# EAGLE board untitled (EAGLE 9.6.2), part 1 of 3
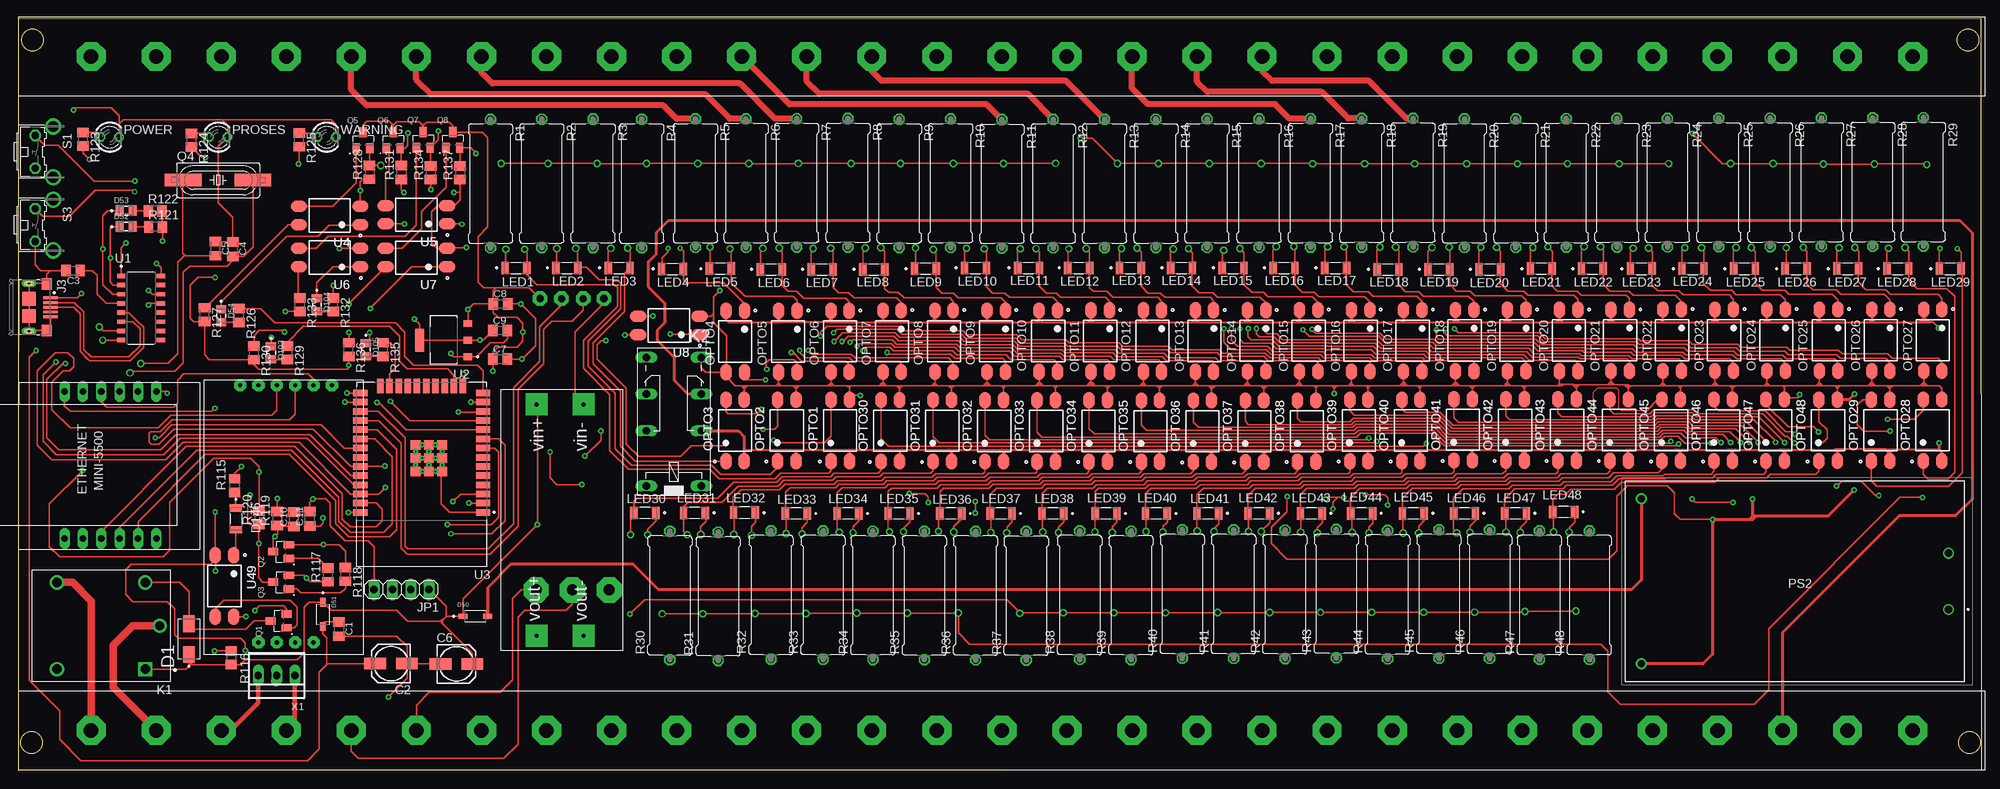
[diagram p2: board, top side]
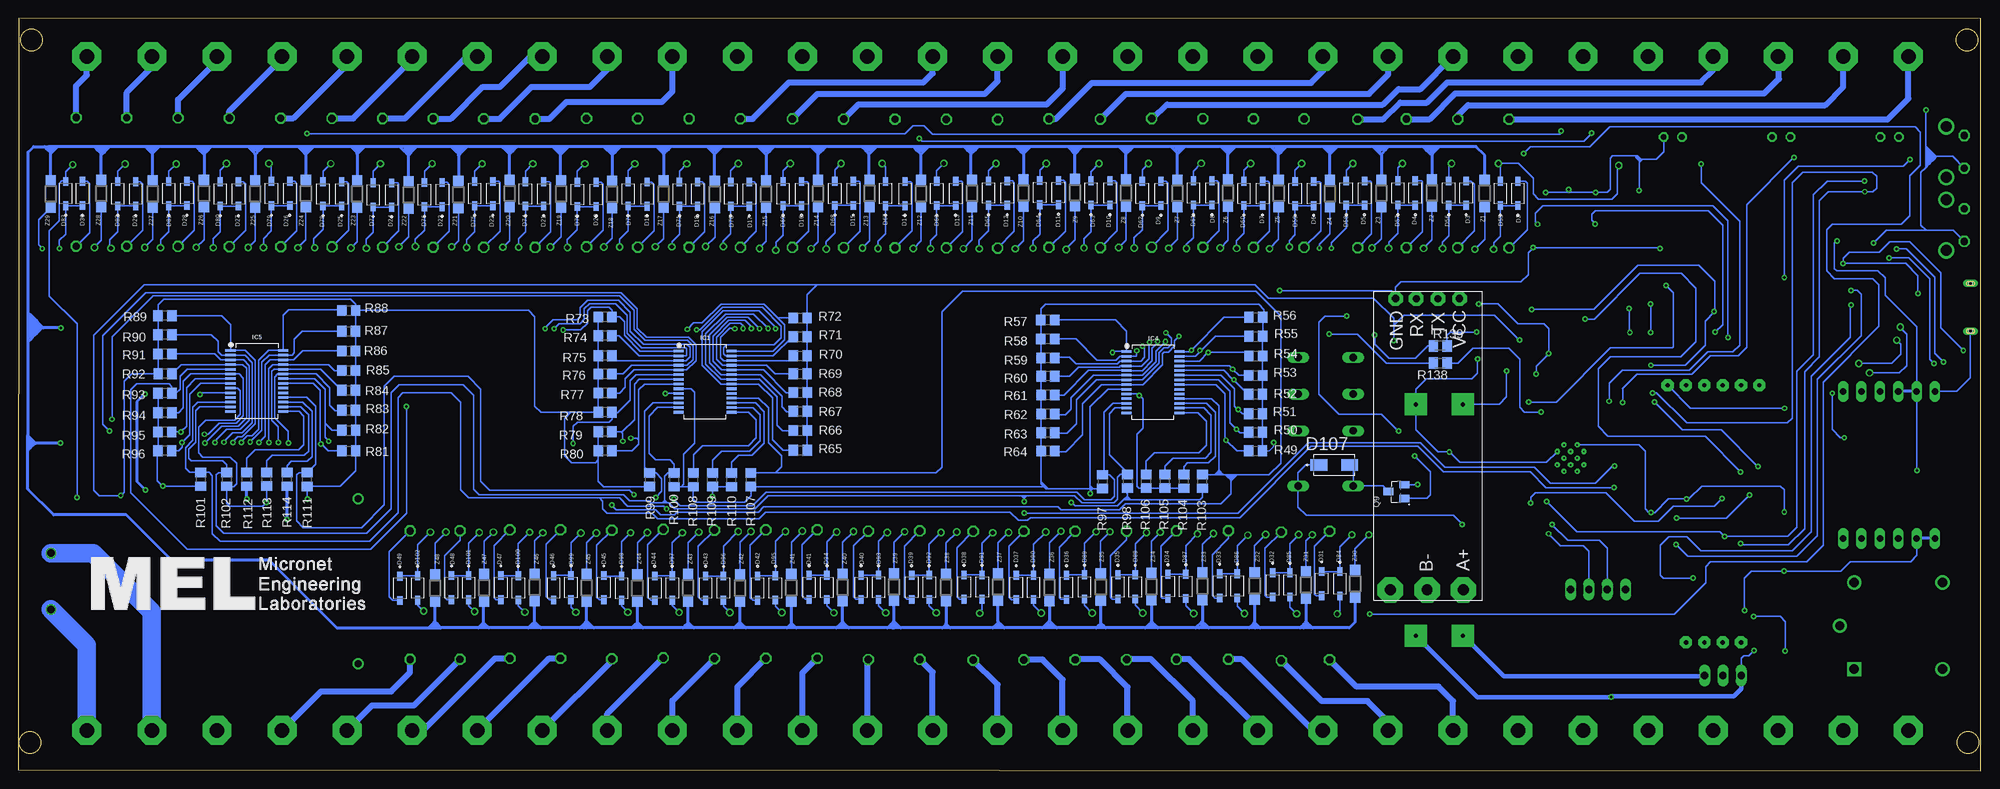
[diagram p3: board, bottom side, seen from below]

Size 271.55 x 104.1 mm. Coordinates in mm from the lower left corner, seen from the top.
Outline: 0,104 271.45,104.1 271.55,0.15 0,0 0,104
Outline: circle at 269.9,3.88 radius 1.48
Outline: circle at 269.7,101.08 radius 1.48
Outline: circle at 1.9,101.08 radius 1.48
Outline: circle at 1.8,3.88 radius 1.48
Copper layers (1*16): Top 0.035mm / dielectric 1.5mm / Bottom 0.035mm
Design rules "default *": minimum track width 6mil, minimum drill 0.3mm, track to track 6mil, track to pad 6mil, pad to pad 6mil, via to via 6mil, smd to smd 6mil, copper to edge 40mil, drill to drill 6mil, minimum pad ring 10mil, minimum via ring 8mil, stop-mask expansion 4mil, vias tented up to drill 0mil, thermal gap 10mil
Net classes: 0 default: drill 0.3 mm, clearance 0.2 mm

## Footprints (pad centres in the part's own frame; a part is rotated, then mirrored left to right if it is on the bottom)
C0805K = smd 1.3 x 1.6: 1 -1,0; 2 1,0
153CLV-0505 = smd 3 x 1.6: + 2.2,0; - -2.2,0
DIOM5226X240N = smd 2.33 x 1.55: A 2.135,0; C -2.135,0
SOD3715X145N = smd 1.21 x 0.73: A 1.68,0; C -1.68,0
LEDC2012X120N = smd 1.1 x 1.45: A 0.9,0; C -0.9,0
LEDC3216X120N = smd 1.01 x 1.73: + -1.51,0; - 1.51,0
HEADER-29P = drill 2 pad 4 octagon: 1 -116.62,5.07; 2 -107.62,5.07; 3 -98.62,5.07; 4 -89.62,5.07; 5 -80.62,5.07; 6 -71.62,5.07; 7 -62.62,5.07; 8 -53.62,5.07; 9 -44.62,5.07; 10 -35.62,5.07; 11 -26.62,5.07; 12 -17.62,5.07; 13 -8.62,5.07; 14 0.38,5.07; 15 9.38,5.07; 16 18.38,5.07; 17 27.38,5.07; 18 36.38,5.07; 19 45.38,5.07; 20 54.38,5.07; 21 63.38,5.07; 22 72.38,5.07; 23 81.38,5.07; 24 90.38,5.07; 25 99.38,5.07; 26 108.38,5.07; 27 117.38,5.07; 28 126.38,5.07; 29 135.38,5.07
SSOP28DB = smd 0.348 x 1.397: 1 -4.225,-3.656; 2 -3.575,-3.656; 3 -2.925,-3.656; 4 -2.275,-3.656; 5 -1.625,-3.656; 6 -0.975,-3.656; 7 -0.325,-3.656; 8 0.325,-3.656; 9 0.975,-3.656; 10 1.625,-3.656; 11 2.275,-3.656; 12 2.925,-3.656; 13 3.575,-3.656; 14 4.225,-3.656; 15 4.225,3.656; 16 3.575,3.656; 17 2.925,3.656; 18 2.275,3.656; 19 1.625,3.656; 20 0.975,3.656; 21 0.325,3.656; 22 -0.325,3.656; 23 -0.975,3.656; 24 -1.625,3.656; 25 -2.275,3.656; 26 -2.925,3.656; 27 -3.575,3.656; 28 -4.225,3.656
FCI_10118193-0001LF = smd 0.4 x 2: 1 -1.3,2.975; 2 -0.65,2.975; 3 0,2.975; 4 0.65,2.975; 5 1.3,2.975 | smd 1.6 x 1.4: S1 -3.2,2.45; S2 3.2,2.45 | smd 1.9 x 1.9: S3 1.2,0; S4 -1.2,0 | drill 0.5 pad 0.9 long: S5 -3.3,0; S6 3.3,0 | hole 0.5: -3.3,0; 3.3,0
1X04 = drill 1.016 long: 1 -3.81,0; 2 -1.27,0; 3 1.27,0; 4 3.81,0
RELAY_SRD-05VDC-SL-C = drill 1.32 square: A1 -6.1,6 | drill 1.32: A2 -6.1,-6; NC 6.1,6; NO 6.1,-6 | drill 1.29: COM -8.1,0
351 = drill 1.016 long: 1 -3.81,-3.81; 16 -3.81,3.81; O1 8.89,-3.81; O2 8.89,3.81; P1 3.81,-3.81; P2 3.81,3.81; S1 13.97,-3.81; S2 13.97,3.81
MT3608 = drill 0.6 pad 3 square: VIN+ 22,-3; VIN- 22,-9.5; VOUT+ -10,-3; VOUT- -10,-9.5
SOT254P975X400-4N = smd 2.25 x 1.6: 1 -4.25,1.27; 2 -4.25,-1.27; 3 4.25,-1.27; 4 4.25,1.27
LED3MM = drill 0.813 octagon: A -1.27,0; K 1.27,0
HLK10M05 = drill 1 pad 1.5: 1 0,0; 2 0,-7.8; 3 42.5,7.5; 4 42.5,-15.3
SOT95P240X120-3N = smd 1 x 1.4: 1 -0.95,-1.1; 2 0.95,-1.1; 3 0,1.1
SM49 = smd 5.08 x 1.778: 1 -4.826,0; 2 4.826,0
0617/17 = drill 1.016 octagon: 1 -8.89,0; 2 8.89,0
R0805 = smd 1.3 x 1.5: 1 -0.95,0; 2 0.95,0
M0805 = smd 1.3 x 1.6: 1 -0.95,0; 2 0.95,0
RTC3231 = drill 0.6 pad 1.676 octagon: 32K -15.24,0; GND -15.24,12.7; GND1 20.32,10.16; SCL -15.24,5.08; SCL1 20.32,2.54; SDA -15.24,7.62; SDA1 20.32,5.08; SQW -15.24,2.54; VCC -15.24,10.16; VCC1 20.32,7.62
B3F-31XX = drill 1.016 octagon: 1 -2.261,-1.245; 2 2.261,-1.245 | drill 1.499 pad 2.159: 3 -3.505,1.245; 4 3.505,1.245
TTL-RS485 = drill 1.5 pad 3.5 octagon: A -19.7,-6; B -19.7,-1; P$7 -19.7,4.1 | drill 1 pad 2 octagon: GND 20.6,3.37; RX 20.581,0.505; TX 20.583,-2.493; VCC 20.6,-5.47
SOIC127P600X180-16N = smd 1.31 x 0.62: 1 -2.75,4.445; 2 -2.75,3.175; 3 -2.75,1.905; 4 -2.75,0.635; 5 -2.75,-0.635; 6 -2.75,-1.905; 7 -2.75,-3.175; 8 -2.75,-4.445; 9 2.75,-4.445; 10 2.75,-3.175; 11 2.75,-1.905; 12 2.75,-0.635; 13 2.75,0.635; 14 2.75,1.905; 15 2.75,3.175; 16 2.75,4.445
SOT229P700X180-4N = smd 1.31 x 0.93: 1 -3.345,2.29; 2 -3.345,0; 3 -3.345,-2.29 | smd 1.31 x 3.24: 4 3.345,0
MODULE_ESP32-WROOM-32D = smd 2 x 0.9: 1 -8.5,5.26; 2 -8.5,3.99; 3 -8.5,2.72; 4 -8.5,1.45; 5 -8.5,0.18; 6 -8.5,-1.09; 7 -8.5,-2.36; 8 -8.5,-3.63; 9 -8.5,-4.9; 10 -8.5,-6.17; 11 -8.5,-7.44; 12 -8.5,-8.71; 13 -8.5,-9.98; 14 -8.5,-11.25; 25 8.5,-11.25; 26 8.5,-9.98; 27 8.5,-8.71; 28 8.5,-7.44; 29 8.5,-6.17; 30 8.5,-4.9; 31 8.5,-3.63; 32 8.5,-2.36; 33 8.5,-1.09; 34 8.5,0.18; 35 8.5,1.45; 36 8.5,2.72; 37 8.5,3.99; 38 8.5,5.26 | smd 0.9 x 2: 15 -5.715,-12.25; 16 -4.445,-12.25; 17 -3.175,-12.25; 18 -1.905,-12.25; 19 -0.635,-12.25; 20 0.635,-12.25; 21 1.905,-12.25; 22 3.175,-12.25; 23 4.445,-12.25; 24 5.715,-12.25 | smd 1.33 x 1.33: 39_1 -2.835,-0.405; 39_2 -1,-0.405; 39_3 0.835,-0.405; 39_4 -2.835,-2.24; 39_5 -1,-2.24; 39_6 0.835,-2.24; 39_7 -2.835,-4.075; 39_8 -1,-4.075; 39_9 0.835,-4.075 | drill 0.2 pad 0.3: 39_10 -1.917,-0.405; 39_11 -0.083,-0.405; 39_12 -2.835,-1.323; 39_13 -1,-1.323; 39_14 0.835,-1.323; 39_15 -1.917,-2.24; 39_16 -0.083,-2.24; 39_17 -2.835,-3.158; 39_18 -1,-3.158; 39_19 0.835,-3.158; 39_20 -1.917,-4.075; 39_21 -0.083,-4.075
MINI_W5500 = drill 0.914 long: 3V3 21.844,-8.89; 3V3.2 21.844,-11.43; CS 1.524,-16.51; GND 1.524,-6.35; GND.2 1.524,-8.89; GND.3 21.844,-6.35; INT 1.524,-19.05; MISO 21.844,-19.05; MOSI 1.524,-11.43; NC 21.844,-13.97; RST 21.844,-16.51; SCLK 1.524,-13.97
22-23-2031 = drill 1 long: 1 -2.54,0; 2 0,0; 3 2.54,0
SOD123 = smd 1.4 x 1.4: A 1.9,0; C -1.9,0

## Placement (x,y rotation side)
C1  1uF  [C0805K]  44.33,19.59 270 top
C2  10uF/16V  [153CLV-0505]  51.52,14.81 180 top
C3  100nF  [C0805K]  7.52,69.16 180 top
C4  22pF  [C0805K]  29.63,72.14 270 top
C5  22pF  [C0805K]  27.23,72.22 270 top
C6  10uF/16V  [153CLV-0505]  60.57,14.78 0 top
C7  1uF  [C0805K]  66.62,56.92 0 top
C8  10uF  [C0805K]  66.66,64.57 0 top
C9  10uF  [C0805K]  66.6,60.86 0 top
C10  100nF  [C0805K]  38.07,34.79 90 top
C11  100nF  [C0805K]  40.27,34.84 90 top
D1  US1M-13  [DIOM5226X240N]  23.56,18.2 90 top
D2  1N5819HW-7  [SOD3715X145N]  64.06,79.85 90 bottom
D3  1N5819HW-7  [SOD3715X145N]  71.2,79.88 90 bottom
D4  1N5819HW-7  [SOD3715X145N]  78.25,79.91 90 bottom
D5  1N5819HW-7  [SOD3715X145N]  85.27,79.88 90 bottom
D6  1N5819HW-7  [SOD3715X145N]  92.3,79.81 90 bottom
D7  1N5819HW-7  [SOD3715X145N]  99.37,79.86 90 bottom
D8  1N5819HW-7  [SOD3715X145N]  106.37,79.92 90 bottom
D9  1N5819HW-7  [SOD3715X145N]  113.44,79.85 90 bottom
D10  1N5819HW-7  [SOD3715X145N]  120.5,79.91 90 bottom
D11  1N5819HW-7  [SOD3715X145N]  127.62,79.96 90 bottom
D12  1N5819HW-7  [SOD3715X145N]  134.7,79.9 90 bottom
D13  1N5819HW-7  [SOD3715X145N]  141.83,79.85 90 bottom
D14  1N5819HW-7  [SOD3715X145N]  148.85,79.81 90 bottom
D15  1N5819HW-7  [SOD3715X145N]  156,79.86 90 bottom
D16  1N5819HW-7  [SOD3715X145N]  163.14,79.81 90 bottom
D17  1N5819HW-7  [SOD3715X145N]  170.38,79.75 90 bottom
D18  1N5819HW-7  [SOD3715X145N]  177.54,79.75 90 bottom
D19  1N5819HW-7  [SOD3715X145N]  184.51,79.74 90 bottom
D20  1N5819HW-7  [SOD3715X145N]  191.57,79.71 90 bottom
D21  1N5819HW-7  [SOD3715X145N]  198.84,79.79 90 bottom
D22  1N5819HW-7  [SOD3715X145N]  205.86,79.83 90 bottom
D23  1N5819HW-7  [SOD3715X145N]  212.86,79.68 90 bottom
D24  1N5819HW-7  [SOD3715X145N]  219.85,79.62 90 bottom
D25  1N5819HW-7  [SOD3715X145N]  226.78,79.79 90 bottom
D26  1N5819HW-7  [SOD3715X145N]  233.95,79.84 90 bottom
D27  1N5819HW-7  [SOD3715X145N]  241.06,79.77 90 bottom
D28  1N5819HW-7  [SOD3715X145N]  248.18,79.84 90 bottom
D29  1N5819HW-7  [SOD3715X145N]  255.28,79.79 90 bottom
D30  1N5819HW-7  [SOD3715X145N]  262.64,79.84 90 bottom
D31  1N5819HW-7  [SOD3715X145N]  91.2,25.87 270 bottom
D32  1N5819HW-7  [SOD3715X145N]  97.98,25.7 270 bottom
D33  1N5819HW-7  [SOD3715X145N]  105.31,25.57 270 bottom
D34  1N5819HW-7  [SOD3715X145N]  112.45,25.5 270 bottom
D35  1N5819HW-7  [SOD3715X145N]  119.36,25.42 270 bottom
D36  1N5819HW-7  [SOD3715X145N]  126.5,25.36 270 bottom
D37  1N5819HW-7  [SOD3715X145N]  133.46,25.34 270 bottom
D38  1N5819HW-7  [SOD3715X145N]  140.66,25.39 270 bottom
D39  1N5819HW-7  [SOD3715X145N]  147.92,25.37 270 bottom
D40  1N5819HW-7  [SOD3715X145N]  154.91,25.37 270 bottom
D41  1N5819HW-7  [SOD3715X145N]  162.12,25.36 270 bottom
D42  1N5819HW-7  [SOD3715X145N]  169.23,25.26 270 bottom
D43  1N5819HW-7  [SOD3715X145N]  176.42,25.27 270 bottom
D44  1N5819HW-7  [SOD3715X145N]  183.47,25.26 270 bottom
D45  1N5819HW-7  [SOD3715X145N]  190.5,25.32 270 bottom
D46  1N5819HW-7  [SOD3715X145N]  197.46,25.3 270 bottom
D47  1N5819HW-7  [SOD3715X145N]  204.76,25.32 270 bottom
D48  1N5819HW-7  [SOD3715X145N]  211.59,25.31 270 bottom
D49  1N5819HW-7  [SOD3715X145N]  218.72,25.23 270 bottom
D50  1N5819HW-7  [SOD3715X145N]  63.19,21.36 0 top
D51  1N5819HW-7  [SOD3715X145N]  42.09,21.63 270 top
D52  SML-LXT0805IW-TR  [LEDC2012X120N]  14.87,75.26 0 top
D53  SML-LXT0805IW-TR  [LEDC2012X120N]  14.87,77.46 0 top
D54  SML-LXT0805IW-TR  [LEDC2012X120N]  28.02,62.92 270 top
D55  1N5819HW-7  [SOD3715X145N]  66.46,79.84 90 bottom
D56  1N5819HW-7  [SOD3715X145N]  73.61,79.9 90 bottom
D57  1N5819HW-7  [SOD3715X145N]  80.64,79.91 90 bottom
D58  1N5819HW-7  [SOD3715X145N]  87.8,79.88 90 bottom
D59  1N5819HW-7  [SOD3715X145N]  94.87,79.82 90 bottom
D60  1N5819HW-7  [SOD3715X145N]  101.96,79.85 90 bottom
D61  1N5819HW-7  [SOD3715X145N]  108.94,79.91 90 bottom
D62  1N5819HW-7  [SOD3715X145N]  116.01,79.83 90 bottom
D63  1N5819HW-7  [SOD3715X145N]  123.11,79.91 90 bottom
D64  1N5819HW-7  [SOD3715X145N]  130.2,79.95 90 bottom
D65  1N5819HW-7  [SOD3715X145N]  137.3,79.89 90 bottom
D66  1N5819HW-7  [SOD3715X145N]  144.45,79.85 90 bottom
D67  1N5819HW-7  [SOD3715X145N]  151.55,79.81 90 bottom
D68  1N5819HW-7  [SOD3715X145N]  158.54,79.86 90 bottom
D69  1N5819HW-7  [SOD3715X145N]  165.7,79.8 90 bottom
D70  1N5819HW-7  [SOD3715X145N]  172.95,79.75 90 bottom
D71  1N5819HW-7  [SOD3715X145N]  180.06,79.74 90 bottom
D72  1N5819HW-7  [SOD3715X145N]  187.14,79.78 90 bottom
D73  1N5819HW-7  [SOD3715X145N]  194.18,79.71 90 bottom
D74  1N5819HW-7  [SOD3715X145N]  201.36,79.78 90 bottom
D75  1N5819HW-7  [SOD3715X145N]  208.39,79.83 90 bottom
D76  1N5819HW-7  [SOD3715X145N]  215.33,79.67 90 bottom
D77  1N5819HW-7  [SOD3715X145N]  222.43,79.65 90 bottom
D78  1N5819HW-7  [SOD3715X145N]  229.36,79.79 90 bottom
D79  1N5819HW-7  [SOD3715X145N]  236.5,79.83 90 bottom
D80  1N5819HW-7  [SOD3715X145N]  243.6,79.77 90 bottom
D81  1N5819HW-7  [SOD3715X145N]  250.7,79.83 90 bottom
D82  1N5819HW-7  [SOD3715X145N]  257.76,79.8 90 bottom
D83  1N5819HW-7  [SOD3715X145N]  264.95,79.82 90 bottom
D84  1N5819HW-7  [SOD3715X145N]  88.68,25.86 270 bottom
D85  1N5819HW-7  [SOD3715X145N]  95.6,25.7 270 bottom
D86  1N5819HW-7  [SOD3715X145N]  102.87,25.56 270 bottom
D87  1N5819HW-7  [SOD3715X145N]  109.99,25.5 270 bottom
D88  1N5819HW-7  [SOD3715X145N]  116.99,25.43 270 bottom
D89  1N5819HW-7  [SOD3715X145N]  124.01,25.42 270 bottom
D90  1N5819HW-7  [SOD3715X145N]  131.06,25.35 270 bottom
D91  1N5819HW-7  [SOD3715X145N]  138.17,25.4 270 bottom
D92  1N5819HW-7  [SOD3715X145N]  145.5,25.37 270 bottom
D93  1N5819HW-7  [SOD3715X145N]  152.5,25.37 270 bottom
D94  1N5819HW-7  [SOD3715X145N]  159.65,25.36 270 bottom
D95  1N5819HW-7  [SOD3715X145N]  166.77,25.29 270 bottom
D96  1N5819HW-7  [SOD3715X145N]  173.97,25.25 270 bottom
D97  1N5819HW-7  [SOD3715X145N]  181.04,25.27 270 bottom
D98  1N5819HW-7  [SOD3715X145N]  188.05,25.24 270 bottom
D99  1N5819HW-7  [SOD3715X145N]  195.06,25.32 270 bottom
D100  1N5819HW-7  [SOD3715X145N]  202.35,25.29 270 bottom
D101  1N5819HW-7  [SOD3715X145N]  209.2,25.31 270 bottom
D102  1N5819HW-7  [SOD3715X145N]  216.26,25.27 270 bottom
D103  SML-LXT0805IW-TR  [LEDC2012X120N]  34.93,57.82 270 top
D104  SML-LXT0805IW-TR  [LEDC2012X120N]  41.26,64.45 270 top
D105  SML-LXT0805IW-TR  [LEDC2012X120N]  48.04,58.25 270 top
D107  US1M-13  [DIOM5226X240N]  89.45,42.29 0 bottom
D146  LHN974_RED_LED_1206  [LEDC3216X120N]  30.06,34.83 270 top
HEADER-29P1  [HEADER-29P]  126.65,93.72 0 top
HEADER-29P2  [HEADER-29P]  126.65,0.52 0 top
IC1  MCP23017SS  [SSOP28DB]  176.51,53.81 270 bottom
IC4  MCP23017SS  [SSOP28DB]  114.53,53.73 270 bottom
IC5  MCP23017SS  [SSOP28DB]  238.51,53.9 270 bottom
J3  10118193-0001LF  [FCI_10118193-0001LF]  1.43,64.09 270 top
JP1  [1X04]  52.96,25.08 180 top
K1  SRD-05VDC-SL-C  [RELAY_SRD-05VDC-SL-C]  11.42,20.04 180 top
K2  351  [351]  90.65,43.2 90 top
LED1  LHN974_RED_LED_1206  [LEDC3216X120N]  68.81,69.56 0 top
LED2  LHN974_RED_LED_1206  [LEDC3216X120N]  75.85,69.56 0 top
LED3  LHN974_RED_LED_1206  [LEDC3216X120N]  83.09,69.56 0 top
LED4  LHN974_RED_LED_1206  [LEDC3216X120N]  90.46,69.41 0 top
LED5  LHN974_RED_LED_1206  [LEDC3216X120N]  97.08,69.45 0 top
LED6  LHN974_RED_LED_1206  [LEDC3216X120N]  104.12,69.35 0 top
LED7  LHN974_RED_LED_1206  [LEDC3216X120N]  111.16,69.35 0 top
LED8  LHN974_RED_LED_1206  [LEDC3216X120N]  118.3,69.35 0 top
LED9  LHN974_RED_LED_1206  [LEDC3216X120N]  125.44,69.45 0 top
LED10  LHN974_RED_LED_1206  [LEDC3216X120N]  132.38,69.55 0 top
LED11  LHN974_RED_LED_1206  [LEDC3216X120N]  139.72,69.55 0 top
LED12  LHN974_RED_LED_1206  [LEDC3216X120N]  146.66,69.55 0 top
LED13  LHN974_RED_LED_1206  [LEDC3216X120N]  153.8,69.55 0 top
LED14  LHN974_RED_LED_1206  [LEDC3216X120N]  160.88,69.54 0 top
LED15  LHN974_RED_LED_1206  [LEDC3216X120N]  168.02,69.54 0 top
LED16  LHN974_RED_LED_1206  [LEDC3216X120N]  175.06,69.54 0 top
LED17  LHN974_RED_LED_1206  [LEDC3216X120N]  182.2,69.54 0 top
LED18  LHN974_RED_LED_1206  [LEDC3216X120N]  189.44,69.34 0 top
LED19  LHN974_RED_LED_1206  [LEDC3216X120N]  196.48,69.34 0 top
LED20  LHN974_RED_LED_1206  [LEDC3216X120N]  203.52,69.34 0 top
LED21  LHN974_RED_LED_1206  [LEDC3216X120N]  210.66,69.44 0 top
LED22  LHN974_RED_LED_1206  [LEDC3216X120N]  217.7,69.44 0 top
LED23  LHN974_RED_LED_1206  [LEDC3216X120N]  224.48,69.43 0 top
LED24  LHN974_RED_LED_1206  [LEDC3216X120N]  231.62,69.43 0 top
LED25  LHN974_RED_LED_1206  [LEDC3216X120N]  238.76,69.43 0 top
LED26  LHN974_RED_LED_1206  [LEDC3216X120N]  245.9,69.43 0 top
LED27  LHN974_RED_LED_1206  [LEDC3216X120N]  253.04,69.43 0 top
LED28  LHN974_RED_LED_1206  [LEDC3216X120N]  259.98,69.43 0 top
LED29  LHN974_RED_LED_1206  [LEDC3216X120N]  267.22,69.43 0 top
LED30  LHN974_RED_LED_1206  [LEDC3216X120N]  86.64,35.67 180 top
LED31  LHN974_RED_LED_1206  [LEDC3216X120N]  93.5,35.67 180 top
LED32  LHN974_RED_LED_1206  [LEDC3216X120N]  100.42,35.68 180 top
LED33  LHN974_RED_LED_1206  [LEDC3216X120N]  107.58,35.58 180 top
LED34  LHN974_RED_LED_1206  [LEDC3216X120N]  114.74,35.58 180 top
LED35  LHN974_RED_LED_1206  [LEDC3216X120N]  121.8,35.58 180 top
LED36  LHN974_RED_LED_1206  [LEDC3216X120N]  128.96,35.58 180 top
LED37  LHN974_RED_LED_1206  [LEDC3216X120N]  135.92,35.58 180 top
LED38  LHN974_RED_LED_1206  [LEDC3216X120N]  143.08,35.58 180 top
LED39  LHN974_RED_LED_1206  [LEDC3216X120N]  150.44,35.58 180 top
LED40  LHN974_RED_LED_1206  [LEDC3216X120N]  157.4,35.58 180 top
LED41  LHN974_RED_LED_1206  [LEDC3216X120N]  164.52,35.59 180 top
LED42  LHN974_RED_LED_1206  [LEDC3216X120N]  171.58,35.59 180 top
LED43  LHN974_RED_LED_1206  [LEDC3216X120N]  178.84,35.59 180 top
LED44  LHN974_RED_LED_1206  [LEDC3216X120N]  185.8,35.59 180 top
LED45  LHN974_RED_LED_1206  [LEDC3216X120N]  192.96,35.59 180 top
LED46  LHN974_RED_LED_1206  [LEDC3216X120N]  200.02,35.59 180 top
LED47  LHN974_RED_LED_1206  [LEDC3216X120N]  207.08,35.59 180 top
LED48  LHN974_RED_LED_1206  [LEDC3216X120N]  213.74,35.79 180 top
MT1  [MT3608]  68.66,28.67 90 top
OPTO1  PC817X2NIP0F  [SOT254P975X400-4N]  113.65,47.04 90 top
OPTO2  PC817X2NIP0F  [SOT254P975X400-4N]  106.27,47.06 90 top
OPTO3  PC817X2NIP0F  [SOT254P975X400-4N]  99.12,47.04 90 top
OPTO4  PC817X2NIP0F  [SOT254P975X400-4N]  99.13,59.36 270 top
OPTO5  PC817X2NIP0F  [SOT254P975X400-4N]  106.43,59.37 270 top
OPTO6  PC817X2NIP0F  [SOT254P975X400-4N]  113.63,59.38 270 top
OPTO7  PC817X2NIP0F  [SOT254P975X400-4N]  120.83,59.39 270 top
OPTO8  PC817X2NIP0F  [SOT254P975X400-4N]  128.03,59.4 270 top
OPTO9  PC817X2NIP0F  [SOT254P975X400-4N]  135.23,59.41 270 top
OPTO10  PC817X2NIP0F  [SOT254P975X400-4N]  142.43,59.42 270 top
OPTO11  PC817X2NIP0F  [SOT254P975X400-4N]  149.63,59.43 270 top
OPTO12  PC817X2NIP0F  [SOT254P975X400-4N]  156.86,59.43 270 top
OPTO13  PC817X2NIP0F  [SOT254P975X400-4N]  164.06,59.44 270 top
OPTO14  PC817X2NIP0F  [SOT254P975X400-4N]  171.26,59.45 270 top
OPTO15  PC817X2NIP0F  [SOT254P975X400-4N]  178.46,59.46 270 top
OPTO16  PC817X2NIP0F  [SOT254P975X400-4N]  185.66,59.47 270 top
OPTO17  PC817X2NIP0F  [SOT254P975X400-4N]  192.86,59.48 270 top
OPTO18  PC817X2NIP0F  [SOT254P975X400-4N]  200.06,59.49 270 top
OPTO19  PC817X2NIP0F  [SOT254P975X400-4N]  207.26,59.5 270 top
OPTO20  PC817X2NIP0F  [SOT254P975X400-4N]  214.46,59.51 270 top
OPTO21  PC817X2NIP0F  [SOT254P975X400-4N]  221.56,59.52 270 top
OPTO22  PC817X2NIP0F  [SOT254P975X400-4N]  228.76,59.53 270 top
OPTO23  PC817X2NIP0F  [SOT254P975X400-4N]  235.96,59.54 270 top
OPTO24  PC817X2NIP0F  [SOT254P975X400-4N]  243.16,59.55 270 top
OPTO25  PC817X2NIP0F  [SOT254P975X400-4N]  250.42,59.53 270 top
OPTO26  PC817X2NIP0F  [SOT254P975X400-4N]  257.62,59.54 270 top
OPTO27  PC817X2NIP0F  [SOT254P975X400-4N]  264.82,59.55 270 top
OPTO28  PC817X2NIP0F  [SOT254P975X400-4N]  264.78,47.09 90 top
OPTO29  PC817X2NIP0F  [SOT254P975X400-4N]  257.6,47.07 90 top
OPTO30  PC817X2NIP0F  [SOT254P975X400-4N]  120.58,47.02 90 top
OPTO31  PC817X2NIP0F  [SOT254P975X400-4N]  127.78,47.01 90 top
OPTO32  PC817X2NIP0F  [SOT254P975X400-4N]  134.98,47 90 top
OPTO33  PC817X2NIP0F  [SOT254P975X400-4N]  142.18,46.99 90 top
OPTO34  PC817X2NIP0F  [SOT254P975X400-4N]  149.38,46.98 90 top
OPTO35  PC817X2NIP0F  [SOT254P975X400-4N]  156.58,46.97 90 top
OPTO36  PC817X2NIP0F  [SOT254P975X400-4N]  163.78,46.96 90 top
OPTO37  PC817X2NIP0F  [SOT254P975X400-4N]  170.98,46.95 90 top
OPTO38  PC817X2NIP0F  [SOT254P975X400-4N]  178.22,46.97 90 top
OPTO39  PC817X2NIP0F  [SOT254P975X400-4N]  185.42,47.06 90 top
OPTO40  PC817X2NIP0F  [SOT254P975X400-4N]  192.62,47.05 90 top
OPTO41  PC817X2NIP0F  [SOT254P975X400-4N]  199.82,47.14 90 top
OPTO42  PC817X2NIP0F  [SOT254P975X400-4N]  207.02,47.13 90 top
OPTO43  PC817X2NIP0F  [SOT254P975X400-4N]  214.22,47.12 90 top
OPTO44  PC817X2NIP0F  [SOT254P975X400-4N]  221.42,47.11 90 top
OPTO45  PC817X2NIP0F  [SOT254P975X400-4N]  228.62,47.1 90 top
OPTO46  PC817X2NIP0F  [SOT254P975X400-4N]  235.82,47.09 90 top
OPTO47  PC817X2NIP0F  [SOT254P975X400-4N]  243.02,47.08 90 top
OPTO48  PC817X2NIP0F  [SOT254P975X400-4N]  250.32,47.07 90 top
POWER  TLLY4400  [LED3MM]  12.62,87.65 0 top
PROSES  TLLY4400  [LED3MM]  27.62,87.65 0 top
PS2  HLK-10M05  [HLK10M05]  267,22.3 180 top
Q1  S9013  [SOT95P240X120-3N]  35.99,20.71 90 top
Q2  MMBT3904  [SOT95P240X120-3N]  36.29,30.31 90 top
Q3  MMBT3904  [SOT95P240X120-3N]  36.29,26.09 90 top
Q4  12MHz  [SM49]  27.6,81.7 0 top
Q5  S9013  [SOT95P240X120-3N]  47.64,87.2 0 top
Q6  S9013  [SOT95P240X120-3N]  51.82,87.2 0 top
Q7  S9013  [SOT95P240X120-3N]  55.96,87.24 0 top
Q8  S9013  [SOT95P240X120-3N]  60.07,87.24 0 top
Q9  S9013  [SOT95P240X120-3N]  80.87,38.6 90 bottom
R1  [0617/17]  65.27,81.21 270 top
R2  [0617/17]  72.37,81.23 270 top
R3  [0617/17]  79.47,81.25 270 top
R4  [0617/17]  86.2,81.22 270 top
R5  [0617/17]  93.63,81.26 270 top
R6  [0617/17]  100.63,81.28 270 top
R7  [0617/17]  107.63,81.3 270 top
R8  [0617/17]  114.73,81.32 270 top
R9  [0617/17]  121.83,81.24 270 top
R10  [0617/17]  128.93,81.26 270 top
R11  [0617/17]  136.03,81.18 270 top
R12  [0617/17]  143.13,81.2 270 top
R13  [0617/17]  150.23,81.22 270 top
R14  [0617/17]  157.33,81.24 270 top
R15  [0617/17]  164.42,81.26 270 top
R16  [0617/17]  171.62,81.28 270 top
R17  [0617/17]  178.72,81.3 270 top
R18  [0617/17]  185.82,81.32 270 top
R19  [0617/17]  192.92,81.34 270 top
R20  [0617/17]  200.02,81.26 270 top
R21  [0617/17]  207.12,81.28 270 top
R22  [0617/17]  214.12,81.3 270 top
R23  [0617/17]  221.12,81.32 270 top
R24  [0617/17]  228.12,81.34 270 top
R25  [0617/17]  235.21,81.36 270 top
R26  [0617/17]  242.31,81.38 270 top
R27  [0617/17]  249.41,81.4 270 top
R28  [0617/17]  256.51,81.42 270 top
R29  [0617/17]  263.51,81.44 270 top
R30  [0617/17]  90.09,24.24 90 top
R31  [0617/17]  96.79,24.12 90 top
R32  [0617/17]  104.09,24.3 90 top
R33  [0617/17]  111.29,24.28 90 top
R34  [0617/17]  118.19,24.26 90 top
R35  [0617/17]  125.3,24.24 90 top
R36  [0617/17]  132.4,24.22 90 top
R37  [0617/17]  139.4,24.2 90 top
R38  [0617/17]  146.8,24.28 90 top
R39  [0617/17]  153.9,24.26 90 top
R40  [0617/17]  161,24.44 90 top
R41  [0617/17]  168.1,24.42 90 top
R42  [0617/17]  175.2,24.4 90 top
R43  [0617/17]  182.3,24.48 90 top
R44  [0617/17]  189.4,24.36 90 top
R45  [0617/17]  196.51,24.44 90 top
R46  [0617/17]  203.51,24.42 90 top
R47  [0617/17]  210.41,24.3 90 top
R48  [0617/17]  217.31,24.28 90 top
R49  [R0805]  100.34,44.25 0 bottom
R50  [R0805]  100.34,46.8 0 bottom
R51  [R0805]  100.34,49.38 0 bottom
R52  [R0805]  100.34,52.05 0 bottom
R53  [R0805]  100.33,54.67 0 bottom
R54  [R0805]  100.31,57.36 0 bottom
R55  [R0805]  100.31,60.07 0 bottom
R56  [R0805]  100.3,62.7 0 bottom
R57  [R0805]  129.09,62.34 180 bottom
R58  [R0805]  129.09,59.7 180 bottom
R59  [R0805]  129.07,57.08 180 bottom
R60  [R0805]  129.06,54.57 180 bottom
R61  [R0805]  129.06,51.96 180 bottom
R62  [R0805]  129.06,49.33 180 bottom
R63  [R0805]  129.07,46.74 180 bottom
R64  [R0805]  129.05,44.23 180 bottom
R65  [R0805]  163.32,44.33 0 bottom
R66  [R0805]  163.33,47.05 0 bottom
R67  [R0805]  163.33,49.7 0 bottom
R68  [R0805]  163.33,52.3 0 bottom
R69  [R0805]  163.35,54.9 0 bottom
R70  [R0805]  163.35,57.4 0 bottom
R71  [R0805]  163.34,60.05 0 bottom
R72  [R0805]  163.34,62.62 0 bottom
R73  [R0805]  190.32,62.76 180 bottom
R74  [R0805]  190.33,60.16 180 bottom
R75  [R0805]  190.34,57.42 180 bottom
R76  [R0805]  190.33,54.87 180 bottom
R77  [R0805]  190.34,52.24 180 bottom
R78  [R0805]  190.33,49.56 180 bottom
R79  [R0805]  190.34,46.89 180 bottom
R80  [R0805]  190.34,44.25 180 bottom
R81  [R0805]  225.8,44.24 0 bottom
R82  [R0805]  225.8,47.07 0 bottom
R83  [R0805]  225.81,49.86 0 bottom
R84  [R0805]  225.81,52.61 0 bottom
R85  [R0805]  225.81,55.36 0 bottom
R86  [R0805]  225.81,58.04 0 bottom
R87  [R0805]  225.81,60.76 0 bottom
R88  [R0805]  225.8,63.66 0 bottom
R89  [R0805]  251.23,62.93 180 bottom
R90  [R0805]  251.22,60.3 180 bottom
R91  [R0805]  251.23,57.64 180 bottom
R92  [R0805]  251.22,54.89 180 bottom
R93  [R0805]  251.23,52.2 180 bottom
R94  [R0805]  251.24,49.52 180 bottom
R95  [R0805]  251.25,46.86 180 bottom
R96  [R0805]  251.25,44.27 180 bottom
R97  [R0805]  121.54,39.98 270 bottom
R98  [R0805]  118.07,40.04 270 bottom
R99  [R0805]  184.16,40.25 270 bottom
R100  [R0805]  180.79,40.23 270 bottom
R101  [R0805]  246.27,40.3 270 bottom
R102  [R0805]  242.69,40.29 270 bottom
R103  [R0805]  107.71,40.02 90 bottom
R104  [R0805]  110.27,40.01 90 bottom
R105  [R0805]  112.88,40.03 90 bottom
R106  [R0805]  115.47,40.04 90 bottom
R107  [R0805]  170.17,40.24 270 bottom
R108  [R0805]  178.12,40.23 90 bottom
R109  [R0805]  175.49,40.23 90 bottom
R110  [R0805]  172.84,40.23 90 bottom
R111  [R0805]  231.56,40.27 90 bottom
R112  [R0805]  239.94,40.29 90 bottom
R113  [R0805]  237.17,40.3 90 bottom
R114  [R0805]  234.33,40.29 90 bottom
R115  [R0805]  29.91,39.43 90 top
R116  [R0805]  29.39,15.62 270 top
R117  10k  [M0805]  42.77,27.09 90 top
R118  10k  [M0805]  45.23,27.16 270 top
R119  10k  [M0805]  35.77,34.89 90 top
R120  10k  [M0805]  33.27,34.99 90 top
R121  330  [M0805]  18.94,75.23 0 top
R122  330  [M0805]  18.89,77.43 0 top
R123  330  [M0805]  8.93,87.35 270 top
R124  330  [M0805]  23.93,87.2 270 top
R125  330  [M0805]  38.83,87.25 270 top
R126  330  [M0805]  30.5,62.95 270 top
R127  10k  [M0805]  25.74,63.08 270 top
R128  10k  [M0805]  48.55,82.75 90 top
R129  330  [M0805]  37.19,57.8 270 top
R130  10k  [M0805]  32.57,57.79 270 top
R131  10k  [M0805]  52.95,82.73 90 top
R132  330  [M0805]  43.53,64.44 270 top
R133  10k  [M0805]  38.91,64.44 270 top
R134  10k  [M0805]  57,82.71 90 top
R135  330  [M0805]  50.42,58.25 270 top
R136  10k  [M0805]  45.67,58.25 270 top
R137  10k  [M0805]  61.06,82.71 90 top
R138  330  [M0805]  74.8,56.38 180 bottom
R139  10k  [M0805]  74.8,58.77 0 bottom
RTC1  [RTC3231]  30.64,38.07 270 top
S1  [B3F-31XX]  3.54,85.6 270 top
S3  [B3F-31XX]  3.54,75.47 270 top
TTL-RS1  [TTL-RS485]  77.6,44.71 90 bottom
U1  CH340G  [SOIC127P600X180-16N]  16.94,64 0 top
U2  AMS1117  [SOT229P700X180-4N]  58.82,59.55 180 top
U3  ESP32-WROOM-32D  [MODULE_ESP32-WROOM-32D]  55.76,40.99 180 top
U4  PC817X2NIP0F  [SOT254P975X400-4N]  43.01,76.81 180 top
U5  PC817X2NIP0F  [SOT254P975X400-4N]  55.02,76.9 180 top
U6  PC817X2NIP0F  [SOT254P975X400-4N]  43.03,70.97 180 top
U7  PC817X2NIP0F  [SOT254P975X400-4N]  55.02,70.96 180 top
U8  PC817X2NIP0F  [SOT254P975X400-4N]  89.96,61.59 180 top
U49  PC817X2NIP0F  [SOT254P975X400-4N]  28.48,25.55 270 top
U$1  MINI_W5500  [MINI_W5500]  0,30.61 90 top
WARNING  TLLY4400  [LED3MM]  42.62,87.65 0 top
X1  22-23-2031  [22-23-2031]  35.68,13.17 180 top
Z1  [SOD123]  68.65,79.86 90 bottom
Z2  [SOD123]  75.95,79.91 90 bottom
Z3  [SOD123]  82.95,79.86 90 bottom
Z4  [SOD123]  90.05,79.81 90 bottom
Z5  [SOD123]  97.15,79.86 90 bottom
Z6  [SOD123]  104.15,79.91 90 bottom
Z7  [SOD123]  111.15,79.86 90 bottom
Z8  [SOD123]  118.25,79.91 90 bottom
Z9  [SOD123]  125.35,79.96 90 bottom
Z10  [SOD123]  132.45,79.91 90 bottom
Z11  [SOD123]  139.55,79.86 90 bottom
Z12  [SOD123]  146.65,79.81 90 bottom
Z13  [SOD123]  153.75,79.86 90 bottom
Z14  [SOD123]  160.85,79.81 90 bottom
Z15  [SOD123]  168.05,79.76 90 bottom
Z16  [SOD123]  175.15,79.71 90 bottom
Z17  [SOD123]  182.25,79.76 90 bottom
Z18  [SOD123]  189.35,79.71 90 bottom
Z19  [SOD123]  196.43,79.79 90 bottom
Z20  [SOD123]  203.53,79.84 90 bottom
Z21  [SOD123]  210.63,79.69 90 bottom
Z22  [SOD123]  217.53,79.64 90 bottom
Z23  [SOD123]  224.63,79.79 90 bottom
Z24  [SOD123]  231.73,79.84 90 bottom
Z25  [SOD123]  238.73,79.79 90 bottom
Z26  [SOD123]  245.83,79.84 90 bottom
Z27  [SOD123]  252.93,79.79 90 bottom
Z28  [SOD123]  260.03,79.84 90 bottom
Z29  [SOD123]  267.03,79.79 90 bottom
Z30  [SOD123]  86.57,25.86 270 bottom
Z31  [SOD123]  93.37,25.71 270 bottom
Z32  [SOD123]  100.47,25.56 270 bottom
Z33  [SOD123]  107.67,25.51 270 bottom
Z34  [SOD123]  114.77,25.46 270 bottom
Z35  [SOD123]  121.77,25.41 270 bottom
Z36  [SOD123]  128.87,25.36 270 bottom
Z37  [SOD123]  135.97,25.41 270 bottom
Z38  [SOD123]  143.17,25.36 270 bottom
Z39  [SOD123]  150.37,25.41 270 bottom
Z40  [SOD123]  157.47,25.36 270 bottom
Z41  [SOD123]  164.57,25.31 270 bottom
Z42  [SOD123]  171.67,25.26 270 bottom
Z43  [SOD123]  178.87,25.31 270 bottom
Z44  [SOD123]  185.87,25.26 270 bottom
Z45  [SOD123]  192.87,25.31 270 bottom
Z46  [SOD123]  200.07,25.36 270 bottom
Z47  [SOD123]  207.07,25.31 270 bottom
Z48  [SOD123]  213.87,25.26 270 bottom

## Tracks (layer width: path | path; a pad name or v marks a point on that pad's centre or on a via)
24+
  Top 0.61: X1.1 38.22,6.78 HEADER-29P2.4
  Bottom 0.61: MT1.VOUT+ 71.58,18.67 65.98,13.07 38.32,13.07 X1.1
A+
  Top 0.203: TTL-RS1.A 69.53,25.01 68.35,23.83 68.35,12.57 66.61,10.83 56.78,10.83 55.03,9.08 HEADER-29P2.6
B-
  Top 0.203: HEADER-29P2.5 46.03,2.7 47,1.73 67.13,1.73 69.09,3.69 69.09,21.25 70,22.16 75.74,22.16 76.6,23.03 TTL-RS1.B
COMM
  Top 0.406: K2.O1 92.63,52.09 90.77,53.94 90.77,57.12 88.41,59.48 88.41,61.01 89.45,62.05 89.45,64.59 87.14,66.9 87.14,70.43 88.23,71.52 88.23,74.44 89.91,76.12 268.55,76.12 270.26,74.41 270.26,37.57 267.94,35.25 260.22,35.25 244.03,19.06 HEADER-29P2.27
COMM1  (via drill 0.35)
  Top 0.203: 107.18,44.39 107.54,44.03 OPTO2.2 107.54,44.03 107.89,44.39 | 114.92,44.01 OPTO1.2 114.92,44.01 | 114.92,44.01 114.55,44.39 | 114.92,44.01 115.31,44.4 | OPTO30.2 121.85,44.01 122.24,44.4 | 129.05,43.97 OPTO31.2 129.05,43.97 | 129.05,43.97 129.48,44.4 | 129.05,43.97 128.62,44.4
  Top 0.305: OPTO4.2 97.86,62.35 98.19,62.02 104.39,62.02 | 104.39,62.02 104.74,62.02 | 104.74,62.02 105.2,62.02 105.19,62.01 | 105.19,62 105.19,62.01 | 105.19,62.01 105.19,63.59 OPTO5.2 | 112.3,62 112.36,62 OPTO6.2 | 112.3,62 111.85,62 | 111.85,62 105.63,62 | 105.63,62 105.19,62 | 105.19,62 105.06,62 | 112.3,62 112.31,62.01 112.85,62.01 | 112.85,62.01 119.09,62.01 | 119.09,62.01 119.39,62.01 | 119.39,62.01 119.65,62.28 119.65,63.55 OPTO7.2 | 120.08,62.02 119.72,62.02 119.71,62.01 | 120.08,62.02 120.29,62.02 | 120.29,62.02 126.26,62.02 | 126.26,62.02 126.61,62.02 | 126.61,62.02 126.78,62.18 126.78,63.63 OPTO8.2 | 126.61,62.02 127.25,62.02 | 127.25,62.02 133.5,62.02 | 133.5,62.02 133.88,62.02 | 133.88,62.02 134,62.14 134,63.62 OPTO9.2 | 140.97,62.02 141.21,62.26 141.21,63.62 OPTO10.2 | 140.97,62.02 141.67,62.02 | 141.67,62.02 147.87,62.02 | 147.87,62.02 148.18,62.02 | 148.36,62.2 OPTO11.2 | 148.81,62.01 155.11,62.01 | 155.11,62.01 155.51,62.01 | 155.51,62.01 155.66,62.16 155.66,63.61 OPTO12.2 | 155.51,62.01 156.13,62.01 | 156.13,62.01 162.35,62.01 | 162.35,62.01 162.66,62.01 | 162.66,62.01 | 162.66,62.01 162.85,62.2 162.85,63.63 OPTO13.2 | 162.66,62.01 163.29,62.01 | 163.29,62.01 169.51,62.01 | 169.51,62.01 169.82,62.01 | 169.82,62.01 170.03,62.22 170.03,63.66 OPTO14.2 | 169.82,62.01 170.5,62.01 | 170.5,62.01 176.7,62.01 | 176.7,62.01 177.04,62.01 | 177.04,62.01 177.19,62.16 OPTO15.2 | 177.04,62.01 177.62,62.01 | 177.62,62.01 183.89,62.01 | 183.89,62.01 183.96,62.01 | 183.96,62.01 184.18,62.01 184.39,62.22 OPTO16.2 | 183.96,62.01 183.96,62.02 184.88,62.02 | 184.88,62.02 191.2,62.02 | 191.2,62.02 | 191.2,62.02 191.89,62.02 | 191.89,62.02 198.34,62.02
  Top 0.305: 198.34,62.02 198.52,62.02 | 198.52,62.02 198.82,62.31 198.82,63.71 OPTO18.2 | 198.52,62.02 199.31,62.02 | 199.31,62.02 205.38,62.02 | 205.38,62.02 205.51,62.02 | 205.51,62.02 | 205.51,62.02 205.79,62.3 | 205.79,62.3 206,62.51 206,63.74 OPTO19.2 | 205.51,62.02 206.49,62.02 | 206.49,62.02 212.67,62.02 | 212.67,62.02 212.82,62.02 | OPTO20.2 213.19,62.39 | 213.19,62.39 212.82,62.02 | 212.82,62.02 213.66,62.02 | 213.66,62.02 219.8,62.02 | 219.8,62.02 219.94,62.02 | OPTO21.2 220.29,62.37 219.94,62.02 | 219.94,62.02 220.24,62.02 | 220.24,62.02 220.77,62.02 | 220.77,62.02 227.24,62.02 | OPTO22.2 227.49,62.27 227.24,62.02 | 227.24,62.02 234.18,62.02 | 234.18,62.02 234.37,62.02 | 234.37,62.02 234.7,62.35 234.7,63.78 OPTO23.2 | 234.37,62.02 235.07,62.02 | 235.07,62.02 235.25,62.02 | 235.25,62.02 241.37,62.02 | 241.37,62.02 241.61,62.02 | OPTO24.2 241.89,62.29 241.61,62.02 | 241.61,62.02 242.31,62.02 | 242.31,62.02 248.74,62.02 | 248.74,62.02 248.86,62.02 | 249.15,62.31 OPTO25.2 249.15,62.43 248.74,62.02 | 248.86,62.02 249.15,62.31 | 248.86,62.02 249.5,62.02 | 249.5,62.02 256.12,62.02 | 256.74,62 262.91,62 | 262.91,62 264.35,62 | v265.64,61.25 264.89,62 264.35,62 | OPTO3.2 100.39,44.06 100.71,44.39 107.18,44.39 107.29,44.39 | OPTO2.2 107.54,44.13 107.29,44.39 | 107.29,44.39 107.89,44.39 114.55,44.39 114.84,44.39 | OPTO1.2 114.92,44.3 114.84,44.39 | 114.84,44.39 114.82,44.4 115.31,44.4 121.6,44.4 | OPTO30.2 121.85,44.15 121.6,44.4 | 121.6,44.4 | 121.6,44.4 122.24,44.4 128.62,44.4 128.82,44.4 | OPTO31.2 129.05,44.17 128.82,44.4 | 128.82,44.4 129.48,44.4 135.98,44.4 | 135.98,44.4 136.13,44.4 | 136.13,44.4 136.31,44.22 136.31,42.81 OPTO32.2
  Top 0.305: 136.13,44.4 136.72,44.4 | 136.72,44.4 142.92,44.4 | 142.92,44.4 143.15,44.4 | 143.15,44.4 143.39,44.4 | OPTO33.2 143.45,44.35 143.4,44.39 | 143.4,44.39 143.39,44.4 | 143.4,44.39 143.91,44.39 | 143.91,44.39 150.16,44.39 | 150.16,44.39 150.42,44.39 | OPTO34.2 150.65,44.17 150.42,44.39 | 150.42,44.39 151.12,44.39 | 151.12,44.39 157.61,44.39 | OPTO35.2 157.85,44.16 157.61,44.39 | 158.03,44.38 157.45,44.38 157.85,43.97 OPTO35.2 | 158.03,44.38 158.16,44.38 | 158.16,44.38 164.61,44.38 | 164.61,44.38 164.84,44.38 | 164.84,44.38 165.11,44.11 165.11,42.77 OPTO36.2 | 164.84,44.38 165.47,44.38 | 165.47,44.38 171.72,44.38 | 171.72,44.38 171.94,44.38 | OPTO37.2 172.25,44.06 171.94,44.38 | 171.94,44.38 172.41,44.38 | 172.41,44.38 172.84,44.38 | 172.84,44.38 179.04,44.38 | 179.04,44.38 179.21,44.38 179.49,44.1 OPTO38.2 | 179.05,44.37 179.04,44.38 | 179.05,44.37 179.8,44.37 | 179.8,44.37 186.37,44.37 186.38,44.36 | 186.38,44.36 186.96,44.36 | 186.96,44.36 193.52,44.36 | 193.52,44.36 193.68,44.36 | OPTO40.2 193.89,44.15 193.68,44.36 | 193.68,44.36 193.68,44.37 194.28,44.37 | 194.28,44.37 200.73,44.37 | 200.73,44.37 201.09,44.01 OPTO41.2 201.09,44.12 201.34,44.37 | 200.73,44.37 201.34,44.37 | 201.34,44.37 207.66,44.37 | 207.66,44.37 207.92,44.37 | 207.92,44.37 208.06,44.37 208.29,44.13 OPTO42.2 | 207.92,44.37 207.91,44.38 208.83,44.38 | 208.83,44.38 215.08,44.38 | 215.08,44.38 215.27,44.38 | 215.27,44.38 215.87,44.38 | 215.87,44.38 222.32,44.38 | 222.32,44.38 222.49,44.38 | OPTO44.2 222.69,44.18 222.49,44.38 | 222.49,44.38 222.47,44.39 222.95,44.39 | 222.95,44.39 229.33,44.39 | 229.33,44.39 229.5,44.39 229.89,44 OPTO45.2 229.89,44.1 230.19,44.4
  Top 0.305: 229.33,44.39 229.32,44.4 230.19,44.4 | 230.19,44.4 236.65,44.4 | OPTO46.2 237.09,43.96 236.65,44.4 | 236.65,44.4 237.05,44.4 | 237.05,44.4 237.46,44.4 | 237.46,44.4 243.63,44.4 | 243.63,44.4 243.86,44.4 244.29,43.97 OPTO47.2 | 244.21,44.41 243.64,44.41 243.63,44.4 | 244.21,44.41 244.77,44.41 | 244.77,44.41 251.2,44.41 | 251.2,44.41 251.37,44.41 | OPTO48.2 251.63,42.86 251.63,44.15 251.37,44.41 | 251.37,44.41 251.34,44.44 251.99,44.44 | 257.98,44.44 258.15,44.44 258.87,43.71 | 257.98,44.44 251.99,44.44 | 258.35,44.43 258.74,44.43 258.97,44.43 | 258.97,44.43 259.43,44.43 | 259.43,44.43 265.77,44.43 | 265.77,44.43 266.07,44.14 266.07,42.86 OPTO28.2 | 265.77,44.43 265.72,44.48 | 258.87,43.71 258.87,43.91 258.35,44.43 | 258.87,43.71 OPTO29.2 | 157.61,44.39 158.02,44.39 158.03,44.38 | 133.88,62.02 134.46,62.02 | 134.46,62.02 140.66,62.02 | 140.66,62.02 140.97,62.02 | 119.71,62.01 119.39,62.01 | 264.35,62 264.04,62.31 | 264.04,62.31 263.76,62.59 | 263.76,62.59 263.61,62.74 263.61,63.74 OPTO27.2 263.55,62.64 263.24,62.33 | OPTO5.2 105.16,62.44 104.74,62.02 | OPTO5.2 105.16,62.47 105.63,62 | OPTO6.2 112.36,62.51 111.85,62 | OPTO6.2 112.36,62.5 112.85,62.01 | OPTO7.2 119.56,62.48 119.09,62.01 | OPTO7.2 119.56,62.54 120.08,62.02 | OPTO8.2 126.76,62.52 126.26,62.02 | OPTO8.2 126.76,62.51 127.25,62.02 | OPTO9.2 133.96,62.48 133.5,62.02 | OPTO9.2 133.96,62.52 134.46,62.02 | OPTO10.2 141.16,62.52 140.66,62.02 | OPTO10.2 141.16,62.53 141.67,62.02 | OPTO11.2 148.36,62.51 147.87,62.02 | OPTO11.2 148.36,62.46 148.81,62.01 | OPTO12.2 155.59,62.49 155.11,62.01 | OPTO12.2 155.59,62.55 156.13,62.01 | OPTO13.2 162.79,62.45 162.35,62.01
  Top 0.305: OPTO13.2 162.79,62.51 163.29,62.01 | OPTO14.2 169.99,62.49 169.51,62.01 | OPTO14.2 169.99,62.52 170.5,62.01 | OPTO15.2 177.19,62.5 176.7,62.01 | OPTO15.2 177.19,62.44 177.62,62.01 | OPTO16.2 184.39,62.51 183.89,62.01 | OPTO16.2 184.39,62.51 184.88,62.02 | 191.2,62.02 191.59,62.41 OPTO17.2 191.59,62.32 191.89,62.02 | OPTO18.2 198.79,62.47 198.34,62.02 | OPTO18.2 198.79,62.53 199.31,62.02 | OPTO19.2 205.99,62.63 205.38,62.02 | OPTO19.2 205.99,62.52 206.21,62.3 | 206.21,62.3 206.49,62.02 | 205.79,62.3 206.21,62.3 | OPTO20.2 213.19,62.54 212.67,62.02 | OPTO20.2 213.19,62.49 213.44,62.24 | 213.44,62.24 213.66,62.02 | 213.19,62.39 213.34,62.24 213.44,62.24 | OPTO21.2 220.29,62.5 219.8,62.02 | OPTO21.2 220.29,62.5 220.48,62.31 | 220.48,62.31 220.77,62.02 | 220.24,62.02 220.48,62.26 220.48,62.31 | OPTO23.2 234.69,62.53 234.18,62.02 | OPTO23.2 234.69,62.4 235.07,62.02 | OPTO23.2 234.69,62.58 235.25,62.02 | OPTO24.2 241.89,62.54 241.37,62.02 | OPTO24.2 241.89,62.44 242.31,62.02 | 249.15,62.31 249.21,62.31 249.5,62.02 | 256.74,62 256.35,62.38 OPTO26.2 256.43,63.71 256.43,62.32 256.12,62.02 | 256.12,62.02 256.14,62 256.74,62 | 263.24,62.33 263.03,62.12 | 263.03,62.12 262.91,62 | 263.03,62.12 263.59,62.12 | 263.59,62.12 263.85,62.12 264.04,62.31 | 263.76,62.59 263.76,62.29 | 263.76,62.29 263.59,62.12 | 263.24,62.33 263.72,62.33 263.76,62.29 | OPTO32.2 136.25,43.93 136.72,44.4 | OPTO32.2 136.25,44.14 135.98,44.4 | OPTO33.2 143.45,43.94 143.91,44.39 | OPTO33.2 143.45,44.1 143.15,44.4 | OPTO33.2 143.45,43.87 142.92,44.4 | OPTO34.2 150.65,43.92 151.12,44.39 | OPTO34.2 150.65,43.9 150.16,44.39 | OPTO35.2 157.85,44.07 158.16,44.38
  Top 0.305: OPTO36.2 165.05,43.95 165.47,44.38 | OPTO36.2 165.05,43.94 164.61,44.38 | OPTO37.2 172.25,43.79 172.84,44.38 | OPTO37.2 172.25,43.85 171.72,44.38 | OPTO37.2 172.25,44.22 172.41,44.38 | OPTO38.2 179.49,44.06 179.8,44.37 | OPTO38.2 179.49,43.93 179.05,44.37 | 186.96,44.36 186.69,44.09 OPTO39.2 186.69,44.05 186.38,44.36 | OPTO40.2 193.89,43.98 194.28,44.37 | OPTO40.2 193.89,43.98 193.52,44.36 | OPTO42.2 208.29,43.84 208.83,44.38 | OPTO42.2 208.29,43.74 207.66,44.37 | OPTO43.2 215.49,44 215.87,44.38 | OPTO43.2 215.49,44.16 215.27,44.38 | OPTO43.2 215.49,43.97 215.08,44.38 | OPTO44.2 222.69,44.13 222.95,44.39 | OPTO44.2 222.69,44.01 222.32,44.38 | OPTO46.2 237.09,44.04 237.46,44.4 | OPTO46.2 237.09,44.36 237.05,44.4 | OPTO47.2 244.29,43.93 244.77,44.41 | OPTO47.2 244.29,44.33 244.21,44.41 | OPTO48.2 251.59,44.04 251.99,44.44 | OPTO48.2 251.59,44.02 251.2,44.41 | OPTO29.2 258.87,44.34 | 258.87,44.34 258.97,44.43 | OPTO29.2 258.87,43.88 259.24,44.25 | 259.24,44.25 259.43,44.43 | 258.87,44.34 259.16,44.34 259.24,44.25 | 147.87,62.02 147.88,62.01 148.81,62.01 | 143.39,44.4 143.9,44.4 143.91,44.39 | 120.29,62.02 120.28,62.01 119.71,62.01 | 105.19,62.01 104.4,62.01 104.39,62.02 | 258.35,44.43 257.98,44.43 257.98,44.44
  Top 0.406: 265.72,44.48 265.7,44.5 v265.7,45.33 | K2.P1 99.59,47.01 100.39,46.21 OPTO3.2
  Bottom 0.406: Z1.A 68.65,85.1 69.86,86.31 74.89,86.31 | 74.89,86.31 75.28,85.92 | 75.28,85.92 75.61,85.59 | 75.61,85.59 75.97,85.23 | 75.97,85.23 75.97,81.83 Z2.A | 74.89,86.31 77.16,86.31 | 77.16,86.31 81.94,86.31 | 81.94,86.31 82.37,85.88 | 82.37,85.88 82.96,85.28 | 82.96,85.28 82.96,81.77 Z3.A | 81.94,86.31 82.52,86.31 | 82.52,86.31 83.1,86.31 | 83.1,86.31 84.12,86.31 | 84.12,86.31 89.03,86.31 | 89.03,86.31 89.29,86.04 | 89.29,86.04 89.67,85.66 | 89.67,85.66 90.06,85.28 | 90.06,85.28 90.06,81.72 Z4.A | 89.03,86.31 91.03,86.31 | 91.03,86.31 96.07,86.31 | Z5.A 97.15,85.23 | 96.07,86.31 96.43,85.95 | 96.43,85.95 96.76,85.62 | 96.76,85.62 97.15,85.23 | 96.07,86.31 98.21,86.31 | 98.21,86.31 103.1,86.31 | Z6.A 104.15,85.26 | 103.1,86.31 103.44,85.97 | 103.44,85.97 103.7,85.72 | 103.7,85.72 104.15,85.26 | 103.1,86.31 105.15,86.31 | 105.15,86.31 110.11,86.31 | Z7.A 111.15,85.27 | 110.11,86.31 110.41,86 | 110.41,86 110.55,85.86 | 110.55,85.86 111.15,85.27 | 110.11,86.31 110.88,86.31 | 111.06,86.31 112.03,86.31 | 112.03,86.31 117.26,86.31 | Z8.A 118.25,85.32 | 117.26,86.31 117.67,85.9 | 117.67,85.9 117.99,85.58 | 117.99,85.58 118.25,85.32 | 117.26,86.31 118.74,86.31 | 118.74,86.31 119.23,86.31 | 119.23,86.31 124.33,86.31 | Z9.A 125.35,85.29 | 124.33,86.31 124.67,85.97 | 124.67,85.97 125.08,85.56 | 125.08,85.56 125.35,85.29 | 124.33,86.31 126.31,86.31 | 126.31,86.31 131.49,86.31 | 131.49,86.31 131.81,85.99 | 131.81,85.99 132.1,85.7 | 132.1,85.7 132.48,85.32 | 132.48,85.32 132.48,81.84 Z10.A | 131.49,86.31 133.47,86.31 | 133.47,86.31 138.7,86.31 | 138.7,86.31 139.11,85.9 | 139.11,85.9 139.41,85.59 | 139.41,85.59 139.69,85.32 | 139.69,85.32 139.69,81.9 Z11.A | 138.7,86.31 140.68,86.31
  Bottom 0.406: 140.68,86.31 145.61,86.31 | Z12.A 146.65,85.27 | 145.61,86.31 145.88,86.04 | 145.88,86.04 146.17,85.75 | 146.17,85.75 146.65,85.27 | 145.61,86.31 147.69,86.31 | 147.69,86.31 152.76,86.31 | 152.76,86.31 153.28,85.79 | 153.28,85.79 153.8,85.27 | 153.8,85.27 153.8,81.81 Z13.A | 152.76,86.31 153.21,86.31 | 153.21,86.31 153.92,86.31 | 153.92,86.31 154.84,86.31 | 154.84,86.31 159.79,86.31 | Z14.A 160.85,85.25 | 159.79,86.31 160.19,85.9 | 160.19,85.9 160.51,85.58 | 160.51,85.58 160.85,85.25 | 159.79,86.31 161.56,86.31 | 161.56,86.31 161.87,86.31 | 161.87,86.31 166.93,86.31 | 168.05,85.19 Z15.A | 166.93,86.31 167.31,85.93 | 167.31,85.93 167.58,85.66 | 167.58,85.66 168.05,85.19 | 166.93,86.31 169.18,86.31 | 169.18,86.31 174.17,86.31 | 174.17,86.31 174.62,85.85 | 174.62,85.85 174.71,85.76 | 174.71,85.76 175.19,85.28 | 175.19,85.28 175.19,81.65 Z16.A | 174.17,86.31 176.22,86.31 | 176.22,86.31 181.22,86.31 | 182.25,85.28 Z17.A | 181.22,86.31 181.55,85.98 | 181.55,85.98 181.79,85.73 | 181.79,85.73 182.25,85.28 | 181.22,86.31 183.2,86.31 | 183.2,86.31 188.21,86.31 | 189.35,85.17 Z18.A | 188.21,86.31 188.61,85.92 | 188.61,85.92 188.9,85.62 | 188.9,85.62 189.35,85.17 | 188.21,86.31 189.27,86.31 | 189.27,86.31 189.63,86.31 | 189.63,86.31 190.44,86.31 | 190.44,86.31 195.41,86.31 | 195.41,86.31 195.67,86.05 | 195.67,86.05 195.87,85.84 | 195.87,85.84 196.23,85.49 | 196.23,85.49 196.49,85.23 | 196.49,85.23 196.49,81.75 Z19.A | 195.41,86.31 196.33,86.31 | 196.33,86.31 197.57,86.31 | 197.57,86.31 202.53,86.31 | 203.55,85.28 203.13,85.71 | 203.13,85.71 202.91,85.92 | 202.91,85.92 202.53,86.31 | 203.55,85.28 203.55,81.76 Z20.A | 202.53,86.31 204.58,86.31 | 204.58,86.31 209.39,86.31
  Bottom 0.406: 210.63,85.07 Z21.A | 209.39,86.31 209.81,85.89 | 209.81,85.89 210.12,85.58 | 210.12,85.58 210.63,85.07 | 209.39,86.31 210.96,86.31 | 210.96,86.31 211.63,86.31 | 211.63,86.31 216.38,86.31 | 216.38,86.31 216.97,85.73 | 216.97,85.73 217.4,85.29 | 217.4,85.29 217.56,85.13 | 217.56,85.13 217.56,81.57 Z22.A | 216.38,86.31 216.83,86.31 | 217.69,86.31 217.7,86.31 | 217.7,86.31 218.74,86.31 | 218.74,86.31 223.62,86.31 | 223.62,86.31 223.88,86.04 | 223.88,86.04 224.29,85.63 | 224.29,85.63 224.64,85.28 | 224.64,85.28 224.64,81.7 Z23.A | 223.62,86.31 225.44,86.31 | 225.44,86.31 230.65,86.31 | 231.73,85.23 Z24.A | 230.65,86.31 230.98,85.97 | 230.98,85.97 231.29,85.67 | 231.29,85.67 231.73,85.23 | 230.65,86.31 232.81,86.31 | 232.81,86.31 237.65,86.31 | 238.73,85.23 Z25.A | 237.65,86.31 238.04,85.92 | 238.04,85.92 238.17,85.79 | 238.17,85.79 238.73,85.23 | 237.65,86.31 238.4,86.31 | 239.03,86.31 239.72,86.31 | 239.72,86.31 244.8,86.31 | 245.83,85.27 Z26.A | 244.8,86.31 245.24,85.86 | 245.24,85.86 245.45,85.66 | 245.45,85.66 245.83,85.27 | 244.8,86.31 245.23,86.31 | 245.23,86.31 245.76,86.31 | 245.76,86.31 246.35,86.31 | 246.35,86.31 246.88,86.31 | 246.88,86.31 252.03,86.31 | 252.03,86.31 252.44,85.9 | 252.44,85.9 252.64,85.69 | 252.64,85.69 252.98,85.36 | 252.98,85.36 252.98,82.22 252.93,82.17 Z27.A | 252.03,86.31 253.92,86.31 | 253.92,86.31 258.89,86.31 | Z28.A 260.03,85.17 | 258.89,86.31 259.3,85.9 | 259.3,85.9 259.58,85.62 | 259.58,85.62 260.03,85.17 | 258.89,86.31 261.03,86.31 | 261.03,86.31 266.08,86.31 | 266.08,86.31 266.5,85.88 | 266.5,85.88 267.05,85.33 | 267.05,85.33 267.05,81.71 Z29.A | Z30.A 86.57,20.56 87.39,19.74 92.47,19.74 | 92.47,19.74 92.82,20.09 | 92.82,20.09 93.15,20.42
  Bottom 0.406: 93.15,20.42 93.39,20.66 | 93.39,20.66 93.39,23.79 Z31.A | 92.47,19.74 93.69,19.74 | 93.69,19.74 94.2,19.74 | 94.2,19.74 99.71,19.74 | Z32.A 100.47,20.51 | 100.47,20.51 100.03,20.07 | 100.03,20.07 99.71,19.74 | 99.71,19.74 100.36,19.74 | 100.36,19.74 101.23,19.74 | 101.23,19.74 106.8,19.74 | Z33.A 107.67,20.61 | 106.8,19.74 107.21,20.16 | 107.21,20.16 107.67,20.61 | 106.8,19.74 108.12,19.74 | 108.12,19.74 108.63,19.74 | 108.63,19.74 113.85,19.74 | Z34.A 114.77,20.66 | 114.77,20.66 114.31,20.2 | 114.31,20.2 114.23,20.12 | 114.23,20.12 113.85,19.74 | 113.85,19.74 115.59,19.74 | 115.59,19.74 121.04,19.74 | 121.04,19.74 121.36,20.06 | 121.36,20.06 121.79,20.49 | 121.79,20.49 121.79,23.49 Z35.A | 121.04,19.74 122.4,19.74 | 122.4,19.74 127.85,19.74 | Z36.A 128.87,20.77 | 127.85,19.74 128.28,20.17 | 128.28,20.17 128.59,20.49 | 128.59,20.49 128.87,20.77 | 127.85,19.74 129.84,19.74 | 129.84,19.74 135.08,19.74 | 135.97,20.63 Z37.A | 135.08,19.74 135.44,20.1 | 135.44,20.1 135.97,20.63 | 135.08,19.74 136.72,19.74 | 136.72,19.74 142.59,19.74 | 142.59,19.74 142.87,20.03 | 142.87,20.03 143.18,20.34 | 143.18,20.34 143.18,23.45 Z38.A | 142.59,19.74 143.66,19.74 | 143.66,19.74 149.46,19.74 | 150.37,20.66 Z39.A | 149.46,19.74 149.89,20.18 | 150.37,20.66 149.89,20.18 | 149.46,19.74 150.32,19.74 | 150.61,19.74 151.28,19.74 | 151.28,19.74 156.6,19.74 | 157.47,20.62 Z40.A | 156.6,19.74 157,20.15 | 157,20.15 157.47,20.62 | 156.6,19.74 158.36,19.74 | 158.36,19.74 163.91,19.74 | 163.91,19.74 164.27,20.11 | 164.27,20.11 164.59,20.43 | 164.59,20.43 164.59,23.39 Z41.A | 163.91,19.74 165.17,19.74 | 165.17,19.74 170.87,19.74 | 170.87,19.74 171.29,20.17 | 171.29,20.17 171.67,20.55 | 171.67,20.55 Z42.A
  Bottom 0.406: 170.87,19.74 172.51,19.74 | 172.51,19.74 178.05,19.74 | 178.87,20.56 Z43.A | 178.05,19.74 178.48,20.17 | 178.48,20.17 178.87,20.56 | 178.05,19.74 179.6,19.74 | 179.6,19.74 185.09,19.74 | 185.87,20.53 Z44.A | 185.09,19.74 185.43,20.09 | 185.43,20.09 185.87,20.53 | 185.09,19.74 186.65,19.74 | 186.65,19.74 191.9,19.74 | 192.87,20.72 Z45.A | 191.9,19.74 192.19,20.04 | 192.19,20.04 192.33,20.18 | 192.33,20.18 192.87,20.72 | 191.9,19.74 192.91,19.74 | 192.91,19.74 193.29,19.74 | 193.29,19.74 193.84,19.74 | 193.84,19.74 199.22,19.74 | 200.07,20.59 Z46.A | 199.22,19.74 199.63,20.15 | 199.63,20.15 199.9,20.43 | 199.9,20.43 200.07,20.59 | 199.22,19.74 200.96,19.74 | 200.96,19.74 206.41,19.74 | 206.41,19.74 206.77,20.11 | 206.77,20.11 207.11,20.45 | 207.11,20.45 207.11,23.37 Z47.A | 206.41,19.74 207.89,19.74 | 207.89,19.74 213.03,19.74 | 213.87,20.58 Z48.A | 213.03,19.74 213.35,20.06 | 213.35,20.06 213.66,20.37 | 213.66,20.37 213.87,20.58 | 214.75,19.74 227.44,19.74 236.82,29.12 250.3,29.12 256.57,35.4 266.63,35.4 270.19,38.96 270.19,44.32 | 214.75,19.74 213.03,19.74 | v265.64,61.25 268.04,61.25 | 268.04,61.25 268.42,61.64 | 268.42,61.64 268.7,61.92 | 268.7,61.92 268.87,62.08 | 268.87,62.08 269.06,62.28 | 269.06,62.28 269.76,62.97 | 269.76,62.97 270.14,63.36 | 270.14,63.36 270.19,63.41 270.19,62.66 | 270.14,63.36 270.14,85.55 269.38,86.31 267.91,86.31 | 267.91,86.31 267.38,86.31 | 270.19,62.66 270.19,62.28 | 270.19,62.28 270.19,61.95 | 270.19,61.95 270.19,61.59 | 270.19,61.59 270.19,61.36 | 270.19,61.36 270.19,60.9 | 270.19,60.9 270.19,60.5 | 270.19,60.5 270.19,60.12 | 270.19,60.12 270.19,59.3 | 270.19,59.3 270.19,46.38 | 270.19,46.38 269.69,45.87 | 269.43,45.62 269.69,45.87
  Bottom 0.406: 269.1,45.29 269.43,45.62 | 269.1,45.29 265.74,45.29 v265.7,45.33 | 270.19,44.32 270.19,45.49 | 270.19,45.49 270.19,46.38 | 268.04,61.25 268.25,61.25 | 268.25,61.25 268.71,60.79 | 268.71,60.79 268.99,60.51 | 268.99,60.51 269.23,60.27 | 269.23,60.27 269.76,59.74 | 269.76,59.74 270.19,59.3 | 269.76,62.97 269.76,62.68 | 269.76,62.68 269.76,61.87 | 269.76,61.87 269.76,59.99 | 269.76,59.99 269.76,59.74 | 269.06,62.28 270.19,62.28 | 269.76,62.68 270.17,62.68 270.19,62.66 | 268.87,62.08 269.55,62.08 269.76,61.87 | 268.7,61.92 270.16,61.92 270.19,61.95 | 268.42,61.64 270.15,61.64 270.19,61.59 | 268.25,61.25 270.08,61.25 270.19,61.36 | 268.71,60.79 268.83,60.9 270.19,60.9 | 268.99,60.51 270.18,60.51 270.19,60.5 | 269.23,60.27 270.04,60.27 270.19,60.12 | 269.76,59.99 270.07,59.99 270.19,60.12 | 269.1,45.29 269.23,45.29 269.43,45.08 | 269.85,44.66 270.19,44.32 | 269.43,45.62 269.43,45.08 | 269.43,45.08 269.85,44.66 | 269.43,45.62 269.85,45.2 | 269.85,45.2 269.85,44.66 | 269.69,45.87 269.81,45.87 270.19,45.49 | 269.69,45.87 269.85,45.7 269.85,45.2 | 213.87,20.58 213.91,20.58 214.22,20.27 | 214.22,20.27 214.39,20.11 | 214.39,20.11 214.75,19.74 | 213.35,20.06 214.35,20.06 214.39,20.11 | 213.66,20.37 213.75,20.27 214.22,20.27 | 207.11,20.45 207.19,20.45 207.52,20.11 | 207.52,20.11 207.89,19.74 | 206.77,20.11 207.52,20.11 | 200.07,20.59 200.11,20.59 200.61,20.09 | 200.61,20.09 200.96,19.74 | 199.63,20.15 199.68,20.09 200.2,20.09 | 200.2,20.09 200.61,20.09 | 199.9,20.43 200.2,20.14 200.2,20.09 | 192.87,20.72 193.05,20.54 | 193.05,20.54 193.41,20.18 | 193.41,20.18 193.84,19.74 | 192.85,20.18 193.41,20.18 | 192.19,20.04 192.55,20.04 192.66,20.15
  Bottom 0.406: 192.66,20.15 193.05,20.54 | 192.33,20.18 192.85,20.18 | 192.85,20.18 193.29,19.74 | 192.66,20.15 192.91,19.91 192.91,19.74 | 185.87,20.53 186.31,20.09 | 186.31,20.09 186.65,19.74 | 185.43,20.09 186.31,20.09 | 178.87,20.56 178.87,20.47 179.27,20.07 | 179.27,20.07 179.6,19.74 | 178.48,20.17 178.57,20.07 179.27,20.07 | 171.67,20.55 171.7,20.55 172.16,20.09 | 172.16,20.09 172.51,19.74 | 171.29,20.17 171.36,20.09 172.16,20.09 | 164.59,20.43 164.59,20.32 164.81,20.11 | 164.81,20.11 165.17,19.74 | 164.27,20.11 164.81,20.11 | 157.47,20.62 157.49,20.62 157.96,20.15 | 157.96,20.15 158.36,19.74 | 157,20.15 157.96,20.15 | 150.37,20.66 150.74,20.29 | 150.74,20.29 150.84,20.19 | 150.84,20.19 151.28,19.74 | 149.89,20.18 150.34,20.18 | 150.6,20.18 150.83,20.18 150.84,20.19 | 149.89,20.18 150.32,19.74 | 150.61,19.74 150.32,19.74 | 150.74,20.29 150.61,20.16 | 150.61,20.16 150.61,19.74 | 150.34,20.18 150.6,20.18 | 150.6,20.18 150.61,20.16 | 150.32,19.74 150.32,20.16 150.34,20.18 | 143.18,20.34 143.18,20.22 143.34,20.06 | 143.34,20.06 143.66,19.74 | 142.87,20.03 143.32,20.03 143.34,20.06 | 135.97,20.63 135.97,20.5 136.28,20.18 | 136.28,20.18 136.72,19.74 | 135.44,20.1 136.2,20.1 136.28,20.18 | 128.87,20.77 128.87,20.71 129.46,20.12 | 129.46,20.12 129.84,19.74 | 128.28,20.17 128.33,20.12 128.97,20.12 | 128.97,20.12 129.46,20.12 | 128.59,20.49 128.97,20.12 | 121.79,20.49 121.79,20.35 122.08,20.06 | 122.08,20.06 122.4,19.74 | 121.36,20.06 122.08,20.06 | 114.77,20.66 114.77,20.56 115.13,20.2 | 115.21,20.12 115.59,19.74 | 114.31,20.2 115.13,20.2 | 115.13,20.2 115.21,20.12 | 114.23,20.12 115.21,20.12 | 107.67,20.61 107.76,20.61 108.63,19.74 | 107.21,20.16 107.71,20.16 108.12,19.74